# Altium project Rechard_Topping.PrjPcb
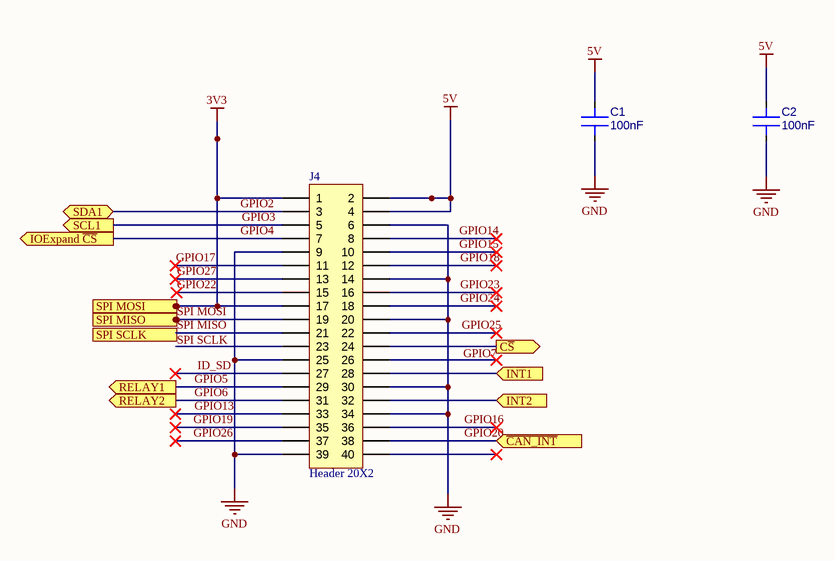
[diagram p0: Processor_Interface.SchDoc]
5 sheets, 31 parts. Net scope: flat (ports and power ports of the same name join across sheets).
Sheets:
  Processor_Interface.SchDoc
  CAN_IO.SchDoc
  Relay_IO.SchDoc
  Digital_IO.SchDoc
  Power_Supply.SchDoc

## Sheet Processor_Interface.SchDoc: Rechard Topping
size 431 x 279 mm; Date: 19-02-2023; ApprovedBy: Rechard Nabo; CheckedBy: Rechard Nabo; Author: Rechard Nabo; CompanyName: Rechard Nabo; DrawnBy: Rechard Nabo; Engineer: Rechard  Nabo; Organization: ORGANIZATION; Address1: ADDRESS 1; Address2: ADDRESS 2; Address3: ADDRESS 3; Address4: ADDRESS 4; Revision: -; SheetNumber: 1; SheetTotal: 5; ENG_APP_DATE: 19-02-2023; DSN_APP_DATE: 19-02-2023; CHK_APP_DATE: 19-02-2023; Time: 16:00

### Parts
C1  100nF  [ALTIUM_CHPC0603]
C2  100nF  [ALTIUM_CHPC0603]
J4  Header 20X2  [HDR2X20]

### Ports
C~{S} (out), INT1 (in), INT2 (in), IOExpand ~{CS} (out), RELAY1 (out), RELAY2 (out), SCL1 (out), SDA1 (bidir), SPI MISO (in), SPI MOSI (out), SPI SCLK (out), ~{CAN_INT} (in)

### Nets
3V3: J4.1 J4.17 ; port SPI MOSI
5V: C1.2 C2.2 J4.2 J4.4
GND: C1.1 C2.1 J4.6 J4.9 J4.14 J4.20 J4.25 J4.30 J4.34 J4.39
GPIO2: J4.3 ; port SDA1
GPIO3: J4.5 ; port SCL1
GPIO4: J4.7 ; port IOExpand ~{CS}
GPIO5: J4.29 ; port RELAY1
GPIO6: J4.31 ; port RELAY2
GPIO13: J4.33
GPIO14: J4.8
GPIO15: J4.10
GPIO16: J4.36
GPIO17: J4.11
GPIO18: J4.12
GPIO19: J4.35
GPIO20: J4.38 ; port ~{CAN_INT}
GPIO22: J4.15
GPIO23: J4.16
GPIO24: J4.18
GPIO25: J4.22
GPIO26: J4.37
GPIO27: J4.13
ID_SD: J4.27
SPI MISO: J4.21
SPI MOSI: J4.19 ; port SPI MISO
NetJ4_24: J4.24 ; port C~{S}
NetJ4_28: J4.28 ; port INT1
NetJ4_32: J4.32 ; port INT2

Not connected (* = marked no-connect by the designer): J4 23 26* 40*

### Notes on the sheet
- Labels drawn without touching a wire or pin: GPIO7, SPI SCLK
- DWG. NO.
- REV.
- SHT.
- THIS DOCUMENT AND THE DATA DISCLOSED HEREIN OR HEREWITH IS THE PROPERTY OF ALTIUM LIMITED AND MAY BE FREELY DISTRIBUTED IN WHOLE. NO RIGHTS ARE RESERVED OR EXPRESS OR IMPLIED WARANTEE GIVEN.
- REVISION
- DESCRIPTION
- DATE
- APPROVED
- ENG:
- APPROVALS
- PROJECT
- DSN:
- CHK:
- REFERENCE DOCUMENTS
- PROJECT REVISION:
- TITLE
- DOCUMENT REVISION:
- DESIGN ITEM:
- BOM:
- FAB DWG:
- PCB DWG:
- ASSY DWG:
- SCALE:
- SIZE
- B
- CAGE CODE
- FILE NAME
- DWG NO.
- SHEET
- OF
- REV

### Library data of the parts
C1 C2 = C0603_100n_±5%_25V_X7R: CAP; 100nF ±5% 25V CERAMIC CHIP X7R (0603); Manufacture Part Number: C0603C104C5GAC; Commodity No: 13 106 033; IC: L; UOM: PC; Drawn: MAKN; SMD: YES; PackageReference: 0603; HelpURL: \\pcb-server\altium libraries\datasheets\KEM_C1003_C0G_SMD.pdf; Dielectric: X7R; Tolerance: ±5%; Volts: 25V; LatestRevisionDate: 12-Dec-2013; ComponentLink1Description: Kemet Datasheet; ComponentLink1URL: \\PCB-Server\Altium Libraries\Datasheets\Capacitors\Kemet\KEM_C1003_C0G_SMD.pdf; ComponentLink2Description: Kemet Link; ComponentLink2URL: http://www.kemet.com/; Value: 100nF
J4 = Header 20X2: Header, 20-Pin, Dual row; LatestRevisionDate: 17-Jul-2002; LatestRevisionNote: Re-released for DXP Platform.; Publisher: Altium Limited

## Sheet CAN_IO.SchDoc: Rechard Topping
size 431 x 279 mm; Date: 19-02-2023; ApprovedBy: Rechard Nabo; CheckedBy: Rechard Nabo; Author: Rechard Nabo; CompanyName: Rechard Nabo; DrawnBy: Rechard Nabo; Engineer: Rechard Nabo; Organization: ORGANIZATION; Address1: ADDRESS 1; Address2: ADDRESS 2; Address3: ADDRESS 3; Address4: ADDRESS 4; Revision: -; SheetNumber: 2; SheetTotal: 5; Title2: Rechard Topping; Project: Rechard Topping; ENG_APP_DATE: 19-02-2023; DSN_APP_DATE: 19-02-2023; CHK_APP_DATE: 19-02-2023
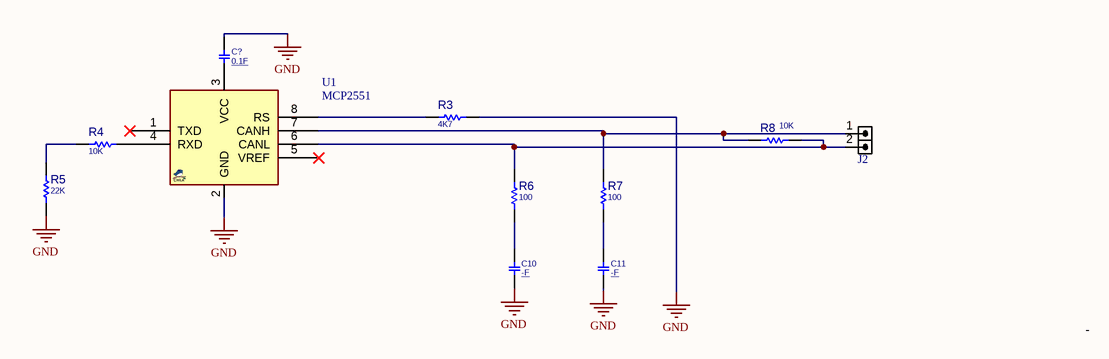
[diagram p1: CAN_IO.SchDoc]

### Parts
C10  -F  [C0805]
C11  -F  [C0805]
C?  0.1F  [C0805]
J2  HDRM2  [HDR_M_1X2]  (value not drawn)
R3  4K7  [R0805]
R4  10K  [R0805]
R5  22K  [R0805]
R6  100  [R0805]
R7  100  [R0805]
R8  10K  [R0805]
U1  MCP2551  [SO_8]

### Nets
GND: C10.1 C11.1 C?.2 R3.2 R5.1 U1.2(GND)
NetC10_2: C10.2 R6.1
NetC11_2: C11.2 R7.1
NetC?_1: C?.1 U1.3(VCC)
NetJ2_1: J2.1 R7.2 R8.2 U1.7(CANH)
NetJ2_2: J2.2 R6.2 R8.1 U1.6(CANL)
NetR3_1: R3.1 U1.8(RS)
NetR4_1: R4.1 R5.2
NetR4_2: R4.2 U1.4(RXD)

Not connected (* = marked no-connect by the designer): U1 1(TXD)* 5(VREF)*

### Notes on the sheet
- -
- DWG. NO.
- REV.
- SHT.
- THIS DOCUMENT AND THE DATA DISCLOSED HEREIN OR HEREWITH IS THE PROPERTY OF ALTIUM LIMITED AND MAY BE FREELY DISTRIBUTED IN WHOLE. NO RIGHTS ARE RESERVED OR EXPRESS OR IMPLIED WARANTEE GIVEN.
- REVISION
- DESCRIPTION
- DATE
- APPROVED
- ENG:
- APPROVALS
- PROJECT
- DSN:
- CHK:
- REFERENCE DOCUMENTS
- PROJECT REVISION:
- TITLE
- DOCUMENT REVISION:
- DESIGN ITEM:
- BOM:
- FAB DWG:
- PCB DWG:
- ASSY DWG:
- SCALE:
- SIZE
- B
- CAGE CODE
- FILE NAME
- DWG NO.
- SHEET
- OF
- REV

### Library data of the parts
C10 C11 C? = CAP_SMD_MLCC_0805: CAP, MLCC, -F, -V, MATERIAL, -%, 0201; PARAM: -, -%; MANF_P#: MANF_PART#; PRICE: 100= 1$; MANF: -; PARAM2: -V; ASSEMBLY: ASSEMBLY
  C10 C11: VALUE: -F
  C?: VALUE: 0.1F
J2 = HDR_M_1X2: CONN, HEADER, Male, pitch: 2.54mm, 2POS; VALUE: HDRM2
R3-R8 = RES_SMD_0805: RESISTOR, SMD; PARAM: -W; DESC: DESCRIPTION; DIST#: MOUSER; PARAM2: 1%; MANF_P#: -; MANF: -; ASSEMBLY: ASSEMBLY; PRICE: 100= 0.5$
  R3: VALUE: 4K7
  R4 R8: VALUE: 10K
  R5: VALUE: 22K
  R6 R7: VALUE: 100
U1 = MCP2551_SOP8: Can, Transceiver, High Speed, 5V (VDD); MANF: MICROCHIP; MANF_P#: MCP2551-I/SN; PARAM2: 5V (VDD), 12/24V; PRICE: 3000toman@PAYA; PARAM: PARAM; VALUE: MCP2551

## Sheet Relay_IO.SchDoc
size 431 x 279 mm; Organization: ORGANIZATION; Address1: ADDRESS 1; Address2: ADDRESS 2; Address3: ADDRESS 3; Address4: ADDRESS 4; Revision: -; SheetNumber: 3; SheetTotal: 5; ENG_APP_DATE: --/--/--; DSN_APP_DATE: --/--/--; CHK_APP_DATE: --/--/--
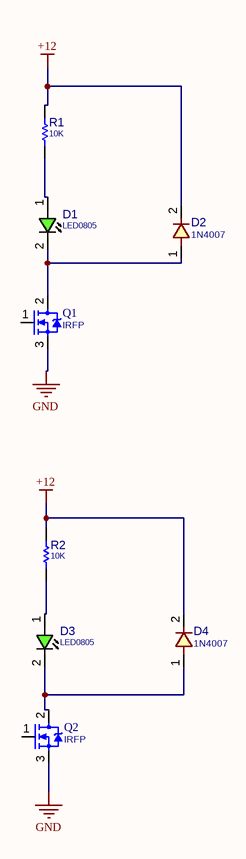
[diagram p2: Relay_IO.SchDoc]

### Parts
D1  LED0805  [LED0805]
D2  1N4007  [D_SMA]
D3  LED0805  [LED0805]
D4  1N4007  [D_SMA]
Q1  IRFP  [TO247_3]
Q2  IRFP  [TO247_3]
R1  10K  [R0805]
R2  10K  [R0805]

### Nets
+12: D2.2 D4.2 R1.2 R2.2
GND: Q1.3(S) Q2.3(S)
NetD1_1: D1.1(ANODE) R1.1
NetD1_2: D1.2(CATHODE) D2.1 Q1.2(D)
NetD3_1: D3.1(ANODE) R2.1
NetD3_2: D3.2(CATHODE) D4.1 Q2.2(D)

Not connected (* = marked no-connect by the designer): Q1 1(G); Q2 1(G)

### Notes on the sheet
- DWG. NO.
- REV.
- SHT.
- THIS DOCUMENT AND THE DATA DISCLOSED HEREIN OR HEREWITH IS THE PROPERTY OF ALTIUM LIMITED AND MAY BE FREELY DISTRIBUTED IN WHOLE. NO RIGHTS ARE RESERVED OR EXPRESS OR IMPLIED WARANTEE GIVEN.
- REVISION
- DESCRIPTION
- DATE
- APPROVED
- ENG:
- APPROVALS
- PROJECT
- DSN:
- CHK:
- REFERENCE DOCUMENTS
- PROJECT REVISION:
- TITLE
- DOCUMENT REVISION:
- DESIGN ITEM:
- BOM:
- FAB DWG:
- PCB DWG:
- ASSY DWG:
- SCALE:
- SIZE
- B
- CAGE CODE
- FILE NAME
- DWG NO.
- SHEET
- OF
- REV

### Library data of the parts
D1 D3 = LED_SMD_0805: LED, SMD, 0805; DESC: DESCRIPTION; MANF_P#: MANF_PART#; PARAM2: 2.2V; MANF: MANF; ASSEMBLY: ASSEMBLY; PRICE: PRICE; VALUE: LED0805
D2 D4 = DIODE_SMD_1N4007: DIODE, GENERAL PURPOSE, 1000V/1A; MANF: Kingtronics; DESC: DESCRIPTION; PARAM: 1000V VRRM; PARAM2: 1A; MANF_P#: M7; ASSEMBLY: ASSEMBLY; PRICE: PRICE; VALUE: 1N4007
Q1 Q2 = MOSN_IRFP: ASSEMBLY: ASSEMBLY; MANF_P#: IRFP; VALUE: IRFP
R1 R2 = RES_SMD_0805: as R3 on sheet CAN_IO; MANF_P#: -; MANF: -; ASSEMBLY: ASSEMBLY; PRICE: 100= 0.5$; VALUE: 10K

## Sheet Digital_IO.SchDoc
size 431 x 279 mm; Organization: ORGANIZATION; Address1: ADDRESS 1; Address2: ADDRESS 2; Address3: ADDRESS 3; Address4: ADDRESS 4; Revision: -; SheetNumber: 4; SheetTotal: 4; ENG_APP_DATE: --/--/--; DSN_APP_DATE: --/--/--; CHK_APP_DATE: --/--/--

### Notes on the sheet
- DWG. NO.
- REV.
- SHT.
- THIS DOCUMENT AND THE DATA DISCLOSED HEREIN OR HEREWITH IS THE PROPERTY OF ALTIUM LIMITED AND MAY BE FREELY DISTRIBUTED IN WHOLE. NO RIGHTS ARE RESERVED OR EXPRESS OR IMPLIED WARANTEE GIVEN.
- REVISION
- DESCRIPTION
- DATE
- APPROVED
- ENG:
- APPROVALS
- PROJECT
- DSN:
- CHK:
- REFERENCE DOCUMENTS
- PROJECT REVISION:
- TITLE
- DOCUMENT REVISION:
- DESIGN ITEM:
- BOM:
- FAB DWG:
- PCB DWG:
- ASSY DWG:
- SCALE:
- SIZE
- B
- CAGE CODE
- FILE NAME
- DWG NO.
- SHEET
- OF
- REV

## Sheet Power_Supply.SchDoc
size 431 x 279 mm; Organization: ORGANIZATION; Address1: ADDRESS 1; Address2: ADDRESS 2; Address3: ADDRESS 3; Address4: ADDRESS 4; Revision: -; SheetNumber: 5; SheetTotal: 5; ENG_APP_DATE: --/--/--; DSN_APP_DATE: --/--/--; CHK_APP_DATE: --/--/--
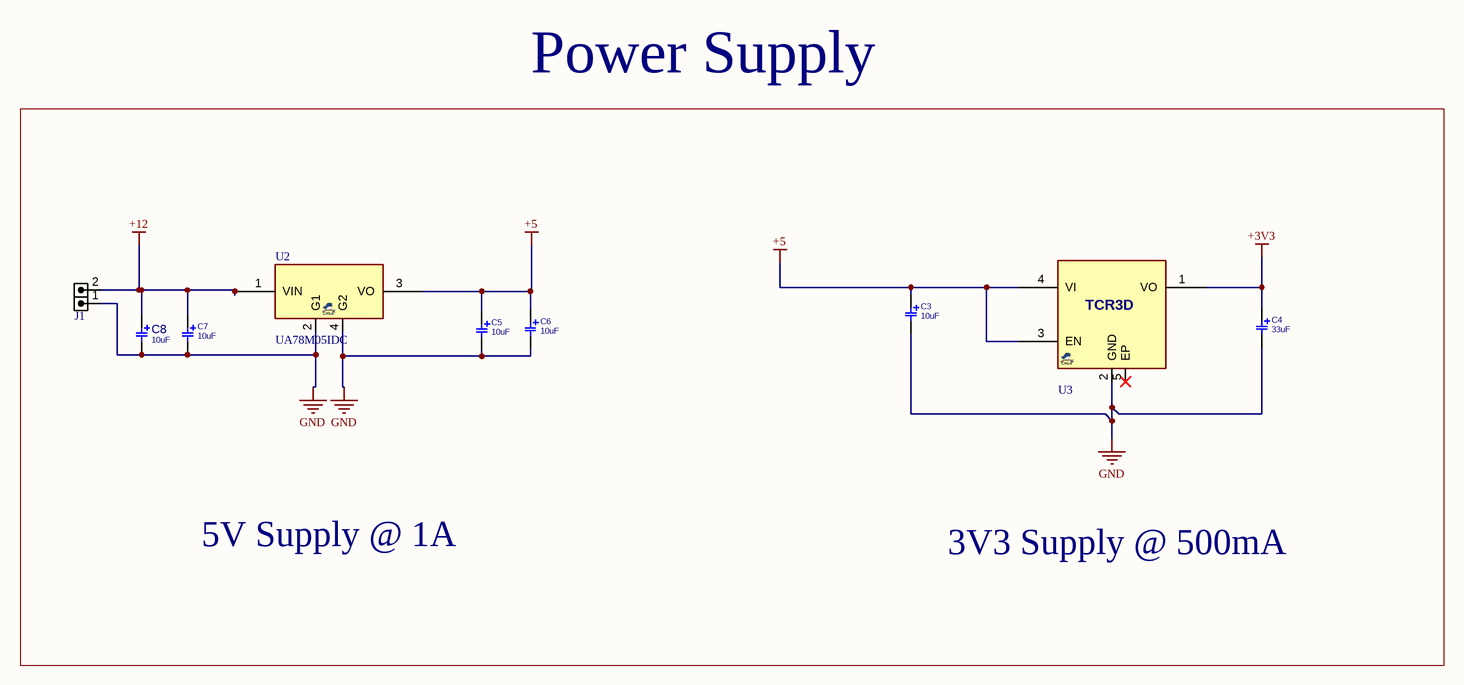
[diagram p3: Power_Supply.SchDoc]

### Parts
C3  10uF  [C_TN_3216]
C4  33uF  [C_TN_3216]
C5  10uF  [C_TN_3216]
C6  10uF  [C_TN_3216]
C7  10uF  [C_TN_3216]
C8  10uF  [C_EL_8]
J1  HDRM2  [HDR_M_1X2]  (value not drawn)
U2  UA78M05IDC  [SOT223_4]
U3  TCR3D  [SON65_4T_1010]  (value not drawn)

### Nets
+3V3: C4.1 U3.1(VO)
+5: C3.1 C5.1 C6.1 U2.3(VO) U3.3(EN) U3.4(VI)
+12: C7.1 C8.1 J1.2 U2.1(VIN)
GND: C3.2 C4.2 C5.2 C6.2 C7.2 C8.2 J1.1 U2.2(G1) U2.4(G2) U3.2(GND)

Not connected (* = marked no-connect by the designer): U3 5(EP)*

### Notes on the sheet
- Power Supply
- 5V Supply @ 1A
- 3V3 Supply @ 500mA
- DWG. NO.
- REV.
- SHT.
- THIS DOCUMENT AND THE DATA DISCLOSED HEREIN OR HEREWITH IS THE PROPERTY OF ALTIUM LIMITED AND MAY BE FREELY DISTRIBUTED IN WHOLE. NO RIGHTS ARE RESERVED OR EXPRESS OR IMPLIED WARANTEE GIVEN.
- REVISION
- DESCRIPTION
- DATE
- APPROVED
- ENG:
- APPROVALS
- PROJECT
- DSN:
- CHK:
- REFERENCE DOCUMENTS
- PROJECT REVISION:
- TITLE
- DOCUMENT REVISION:
- DESIGN ITEM:
- BOM:
- FAB DWG:
- PCB DWG:
- ASSY DWG:
- SCALE:
- SIZE
- B
- CAGE CODE
- FILE NAME
- DWG NO.
- SHEET
- OF
- REV

### Library data of the parts
C3-C7 = CAP_SMD_TAN_3216: CAP, SMD, TAN,; PARAM2: -V
  C3 C5-C7: VALUE: 10uF
  C4: VALUE: 33uF
C8 = CAP_SMD_EL: CAP, THD, ELEC,; MANF_P#: MANF_PART#; PARAM2: -V; DESC: DESCRIPTION; DIST#: MOUSER; PARAM: 20%; PRICE: 10= -$; MANF: MANF; ASSEMBLY: ASSEMBLY; VALUE: 10uF
J1 = HDR_M_1X2: CONN, HEADER, Male, pitch: 2.54mm, 2POS; VALUE: HDRM2
U2 = VREG_78M05_SOT223: REG, Linear, Fixed, 5v, 0.5A, SOT-223; MANF_P#: UA78M05IDCYR; MANF: TI; PARAM: 5v, 0.5A; PARAM2: PARAM2; VALUE: UA78M05IDC
U3 = VREG_TCR3D_DFN4: REG, Linear, LDO0.3V, Fixed, 300mA, VIN2~5.25V, VOUT1~4.5V,DFN4 1X1mm; MANF: TOSHIBA; MANF_P#: TCR3DM10, TCR3DM105, TCR3DM12, TCR3DM15, TCR3DM18, TCR3DM25, TCR3DM33; PARAM2: 70dB PSRR; PARAM: LDO0.2V, Fixed, 300mA; PRICE: $0.3; VALUE: TCR3D

## Nets that join several sheets
+12: Relay_IO (D2.2 D4.2 R1.2 R2.2), Power_Supply (C7.1 C8.1 J1.2 U2.1)
GND: Processor_Interface (10 pins), CAN_IO (6 pins), Relay_IO (Q1.3 Q2.3), Power_Supply (10 pins)